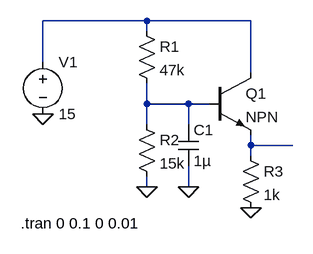
[diagram p0: schematic bias buffer.asc]
bias buffer.asc, the LTspice schematic file:
Version 4
SHEET 1 880 680
WIRE 80 48 -80 48
WIRE 240 48 80 48
WIRE 80 64 80 48
WIRE -80 112 -80 48
WIRE 240 128 240 48
WIRE 80 176 80 144
WIRE 144 176 80 176
WIRE 176 176 144 176
WIRE 80 208 80 176
WIRE 144 208 144 176
WIRE 240 240 240 224
WIRE 304 240 240 240
WIRE 240 256 240 240
WIRE 80 304 80 288
WIRE 144 304 144 272
FLAG -80 192 0
FLAG 80 304 0
FLAG 144 304 0
FLAG 240 336 0
DATAFLAG -48 48 ""
DATAFLAG 80 176 ""
DATAFLAG 256 240 ""
SYMBOL npn 176 128 R0
SYMATTR InstName Q1
SYMBOL res 64 48 R0
SYMATTR InstName R1
SYMATTR Value 47k
SYMBOL res 64 192 R0
SYMATTR InstName R2
SYMATTR Value 15k
SYMBOL voltage -80 96 R0
WINDOW 123 0 0 Left 0
WINDOW 39 0 0 Left 0
SYMATTR InstName V1
SYMATTR Value 15
SYMBOL cap 128 208 R0
SYMATTR InstName C1
SYMATTR Value 1µ
SYMBOL res 224 240 R0
SYMATTR InstName R3
SYMATTR Value 1k
TEXT -114 360 Left 2 !.tran 0 0.1 0 0.01

The netlist it stands for:
* bias buffer.asc
Q1 N001 N002 N003 0 NPN
R1 N001 N002 47k
R2 N002 0 15k
V1 N001 0 15
C1 N002 0 1µ
R3 N003 0 1k
.model NPN NPN
.model PNP PNP
.lib standard.bjt
.tran 0 0.1 0 0.01
.backanno
.end